# Altium schematic sheet LED_MAX.SchDoc
size 420 x 297 mm; Address1: Address1; Address2: Address2; Address3: Address3; Address4: Address4; SheetNumber: 1; Scale: 1:1; Разраб.: Иванов; Обозначение документа: АБВГ.123456.001 Э3; Пров.: Петров; Утв.: Сидоров; Наименование организации: ОАО "Концерн "МПО-Гидроприбор"; Перв. применение: АБВГ.123456.000; Наименование изделия 1: Плата; Наименование изделия 2: Схема электрическая; Наименование изделия 3: принципиальная; Нач. отд.: Нач. отд.; Фамилия нач. отд.: Сидоров
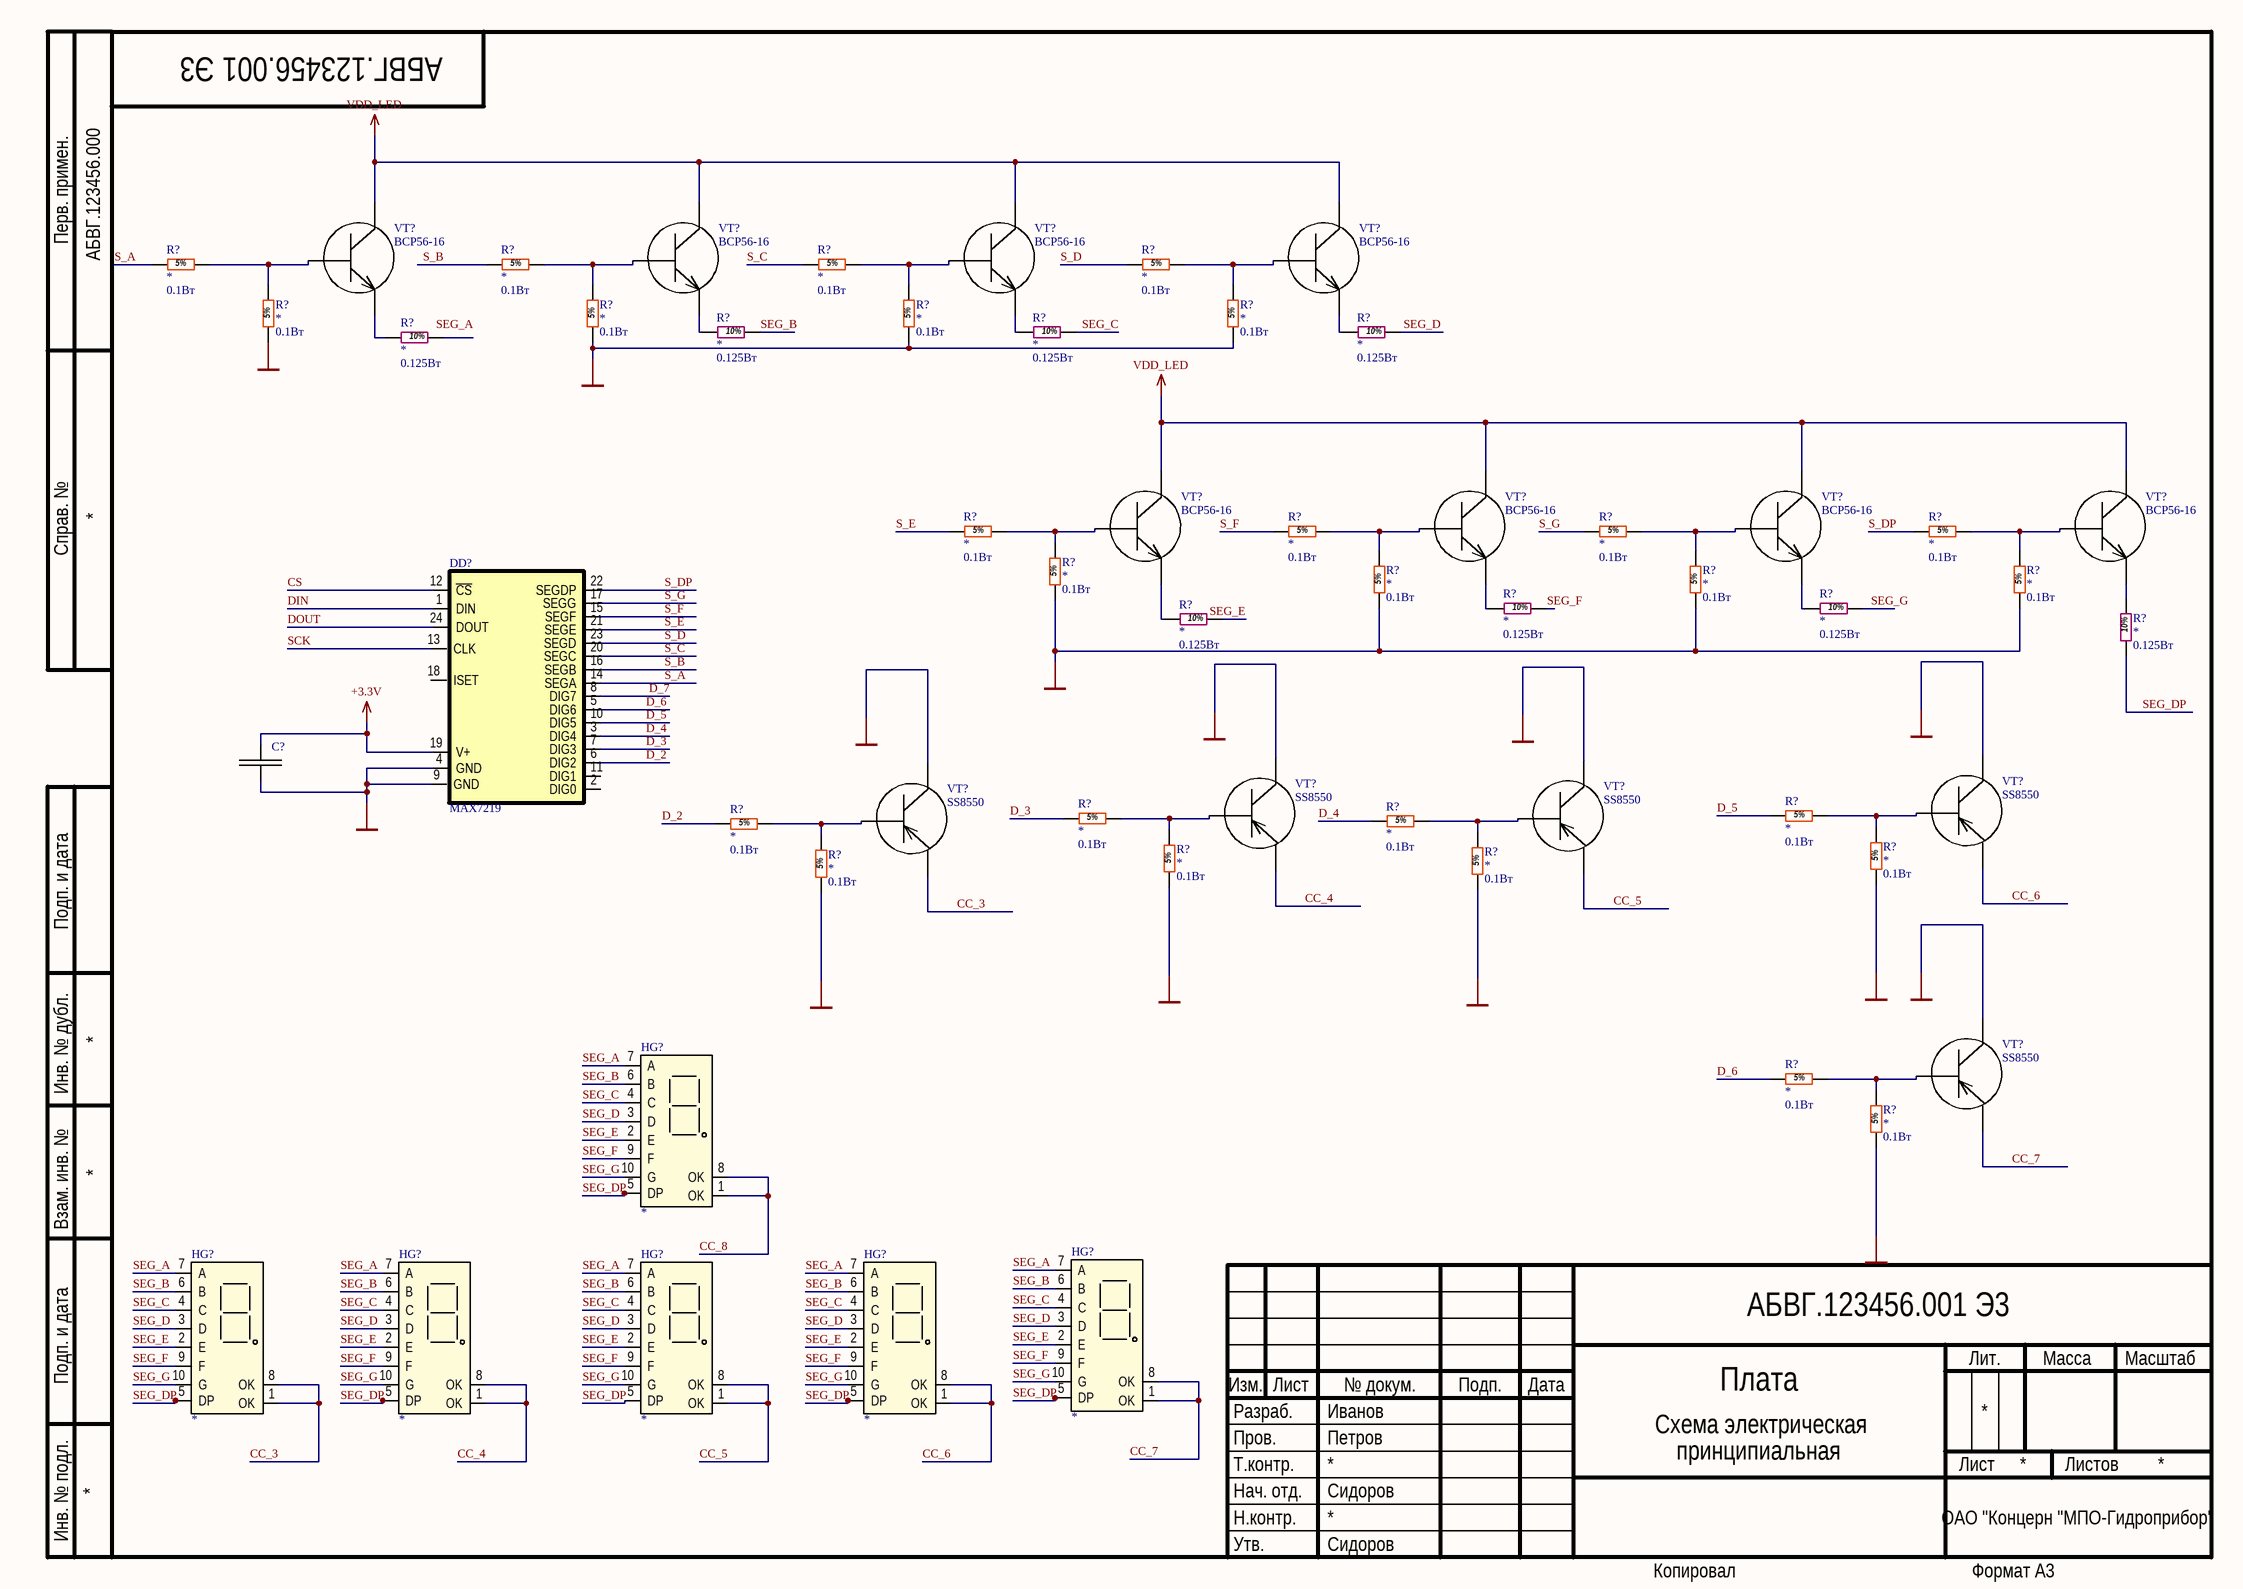
[diagram p0: LED_MAX.SchDoc]

## Parts
(Parts that share a designator on the sheet are numbered #1, #2 ... from top to bottom, then left to right.)
C?  *  [CH0603L]  (value not drawn)
DD?  MAX7219  [SO-24]
HG?#1  *  [FYS-40011]
HG?#2  *  [FYS-40011]
HG?#3  *  [FYS-40011]
HG?#4  *  [FYS-40011]
HG?#5  *  [FYS-40011]
HG?#6  *  [FYS-40011]
R?#1  Power: 0.1Вт  [Res0603]  (hidden comment: *)
R?#2  Power: 0.1Вт  [Res0603]  (hidden comment: *)
R?#3  Power: 0.1Вт  [Res0603]  (hidden comment: *)
R?#4  Power: 0.1Вт  [Res0603]  (hidden comment: *)
R?#5  Power: 0.1Вт  [Res0603]  (hidden comment: *)
R?#6  Power: 0.1Вт  [Res0603]  (hidden comment: *)
R?#7  Power: 0.1Вт  [Res0603]  (hidden comment: *)
R?#8  Power: 0.1Вт  [Res0603]  (hidden comment: *)
R?#9  Power: 0.125Вт  [RES0805]  (hidden comment: *)
R?#10  Power: 0.125Вт  [RES0805]  (hidden comment: *)
R?#11  Power: 0.125Вт  [RES0805]  (hidden comment: *)
R?#12  Power: 0.125Вт  [RES0805]  (hidden comment: *)
R?#13  Power: 0.1Вт  [Res0603]  (hidden comment: *)
R?#14  Power: 0.1Вт  [Res0603]  (hidden comment: *)
R?#15  Power: 0.1Вт  [Res0603]  (hidden comment: *)
R?#16  Power: 0.1Вт  [Res0603]  (hidden comment: *)
R?#17  Power: 0.1Вт  [Res0603]  (hidden comment: *)
R?#18  Power: 0.1Вт  [Res0603]  (hidden comment: *)
R?#19  Power: 0.1Вт  [Res0603]  (hidden comment: *)
R?#20  Power: 0.1Вт  [Res0603]  (hidden comment: *)
R?#21  Power: 0.125Вт  [RES0805]  (hidden comment: *)
R?#22  Power: 0.125Вт  [RES0805]  (hidden comment: *)
R?#23  Power: 0.125Вт  [RES0805]  (hidden comment: *)
R?#24  Power: 0.125Вт  [RES0805]  (hidden comment: *)
R?#25  Power: 0.1Вт  [Res0603]  (hidden comment: *)
R?#26  Power: 0.1Вт  [Res0603]  (hidden comment: *)
R?#27  Power: 0.1Вт  [Res0603]  (hidden comment: *)
R?#28  Power: 0.1Вт  [Res0603]  (hidden comment: *)
R?#29  Power: 0.1Вт  [Res0603]  (hidden comment: *)
R?#30  Power: 0.1Вт  [Res0603]  (hidden comment: *)
R?#31  Power: 0.1Вт  [Res0603]  (hidden comment: *)
R?#32  Power: 0.1Вт  [Res0603]  (hidden comment: *)
R?#33  Power: 0.1Вт  [Res0603]  (hidden comment: *)
R?#34  Power: 0.1Вт  [Res0603]  (hidden comment: *)
VT?#1  BCP56-16  [SOT223]
VT?#2  BCP56-16  [SOT223]
VT?#3  BCP56-16  [SOT223]
VT?#4  BCP56-16  [SOT223]
VT?#5  BCP56-16  [SOT223]
VT?#6  BCP56-16  [SOT223]
VT?#7  BCP56-16  [SOT223]
VT?#8  BCP56-16  [SOT223]
VT?#9  SS8550  [SOT23-3]
VT?#10  SS8550  [SOT23-3]
VT?#11  SS8550  [SOT23-3]
VT?#12  SS8550  [SOT23-3]
VT?#13  SS8550  [SOT23-3]

## Nets
+3.3V: C?.1 DD?.19(V+)
GND: C?.2 DD?.4(GND) DD?.9(GND) R?#5.1 R?#6.1 R?#7.1 R?#8.1 R?#17.1 R?#18.1 R?#19.1 R?#20.1 R?#29.1 R?#30.1 R?#31.1 R?#32.1 R?#34.1 VT?#9.3 VT?#10.3 VT?#11.3 VT?#12.3 VT?#13.3
VDD_LED: VT?#1.2 VT?#2.2 VT?#3.2 VT?#4.2 VT?#5.2 VT?#6.2 VT?#7.2 VT?#8.2
CC_3: HG?#2.1(OK) HG?#2.8(OK) VT?#11.2
CC_4: HG?#3.1(OK) HG?#3.8(OK) VT?#9.2
CC_5: HG?#4.1(OK) HG?#4.8(OK) VT?#12.2
CC_6: HG?#5.1(OK) HG?#5.8(OK) VT?#10.2
CC_7: HG?#6.1(OK) HG?#6.8(OK) VT?#13.2
CC_8: HG?#1.1(OK) HG?#1.8(OK)
CS: DD?.12(~{CS})
D_2: DD?.6(DIG2) R?#26.1
D_3: DD?.7(DIG3) R?#27.1
D_4: DD?.3(DIG4) R?#28.1
D_5: DD?.10(DIG5) R?#25.1
D_6: DD?.5(DIG6) R?#33.1
D_7: DD?.8(DIG7)
DIN: DD?.1(DIN)
DOUT: DD?.24(DOUT)
S_A: DD?.14(SEGA) R?#1.1
S_B: DD?.16(SEGB) R?#2.1
S_C: DD?.20(SEGC) R?#3.1
S_D: DD?.23(SEGD) R?#4.1
S_DP: DD?.22(SEGDP) R?#16.1
S_E: DD?.21(SEGE) R?#13.1
S_F: DD?.15(SEGF) R?#14.1
S_G: DD?.17(SEGG) R?#15.1
SCK: DD?.13(CLK)
SEG_A: HG?#1.7(A) HG?#2.7(A) HG?#3.7(A) HG?#4.7(A) HG?#5.7(A) HG?#6.7(A)
SEG_B: HG?#1.6(B) HG?#2.6(B) HG?#3.6(B) HG?#4.6(B) HG?#5.6(B) HG?#6.6(B) R?#10.2
SEG_C: HG?#1.4(C) HG?#2.4(C) HG?#3.4(C) HG?#4.4(C) HG?#5.4(C) HG?#6.4(C) R?#11.2
SEG_D: HG?#1.3(D) HG?#2.3(D) HG?#3.3(D) HG?#4.3(D) HG?#5.3(D) HG?#6.3(D) R?#12.2
SEG_DP: HG?#1.5(DP) HG?#2.5(DP) HG?#3.5(DP) HG?#4.5(DP) HG?#5.5(DP) HG?#6.5(DP) R?#24.1
SEG_E: HG?#1.2(E) HG?#2.2(E) HG?#3.2(E) HG?#4.2(E) HG?#5.2(E) HG?#6.2(E)
SEG_F: HG?#1.9(F) HG?#2.9(F) HG?#3.9(F) HG?#4.9(F) HG?#5.9(F) HG?#6.9(F) R?#21.2
SEG_G: HG?#1.10(G) HG?#2.10(G) HG?#3.10(G) HG?#4.10(G) HG?#5.10(G) HG?#6.10(G) R?#22.2
NetR?#1_2: R?#1.2 R?#5.2 VT?#1.1
NetR?#2_2: R?#2.2 R?#6.2 VT?#2.1
NetR?#3_2: R?#3.2 R?#7.2 VT?#3.1
NetR?#4_2: R?#4.2 R?#8.2 VT?#4.1
NetR?#9_1: R?#9.1 VT?#1.3
NetR?#10_1: R?#10.1 VT?#2.3
NetR?#11_1: R?#11.1 VT?#3.3
NetR?#12_1: R?#12.1 VT?#4.3
NetR?#13_2: R?#13.2 R?#17.2 VT?#5.1
NetR?#14_2: R?#14.2 R?#18.2 VT?#6.1
NetR?#15_2: R?#15.2 R?#19.2 VT?#7.1
NetR?#16_2: R?#16.2 R?#20.2 VT?#8.1
NetR?#21_1: R?#21.1 VT?#6.3
NetR?#22_1: R?#22.1 VT?#7.3
NetR?#23_1: R?#23.1 VT?#5.3
NetR?#24_2: R?#24.2 VT?#8.3
NetR?#25_2: R?#25.2 R?#30.2 VT?#10.1
NetR?#26_2: R?#26.2 R?#31.2 VT?#11.1
NetR?#27_2: R?#27.2 R?#29.2 VT?#9.1
NetR?#28_2: R?#28.2 R?#32.2 VT?#12.1
NetR?#33_2: R?#33.2 R?#34.2 VT?#13.1

Not connected (* = marked no-connect by the designer): DD? 2(DIG0) 11(DIG1) 18(ISET); R?#9 2; R?#23 2

## Notes on the sheet
- Labels drawn without touching a wire or pin: SEG_A, SEG_E
- Перв. примен.
- Справ. №
- Подп. и дата
- Инв. № дубл.
- Взам. инв. №
- Разраб.
- Изм.
- Лист
- № докум.
- Подп.
- Дата
- Лит.
- Масса
- Масштаб
- Пров.
- Т.контр.
- Листов
- Инв. № подл.
- Утв.
- Н.контр.
- Копировал
- Формат А3

## Library data of the parts
C? = Capasitor: Value: *; Voltage: *; Part Number: *; Quantity: *; Package: *; Price: *; Manufacturer: *; ShoppingPlace: *
DD? = MAX7219: Manufacturer: MAXIM; Part Number: MAX7219; Package: SO-24; Quantity: 1; Tolerance: *; Type: IC; Voltage: *; Power: *
HG?#1-HG?#6 = LED Indicator: Value: *; Quantity: *; Part Number: *; Manufacturer: *; Package: *; Price: *; ShoppingPlace: *; Documentation: *; Type: HG
R?#1-R?#8 R?#13-R?#20 R?#25-R?#34 = Res0603_5%: Voltage: 50В; Tolerance: 5%; Manufacturer: *; Quntity: *; Price: *; Part Number: *; Package: 0603; Doc: *; Value: *
R?#9-R?#12 R?#21-R?#24 = Res0805_10%: Voltage: 150В; Tolerance: 10%; Manufacturer: *; Quntity: *; Price: *; Part Number: *; Package: 0805; Doc: *; Value: *
VT?#1-VT?#8 = BCP56-16: Manufacturer: NXP Semiconductors; Value: 80V,1A; Part Number: BCP56-16; Price: BCP56; Quantity: 2; Documentation: https://assets.nexperia.com/documents/data-sheet/BCP56_BCX56_BC56PA.pdf
VT?#9-VT?#13 = SS8550: Manufacturer: NXP; Value: 45V,100mA; Part Number: SS8550; Price: 1; ShoppingPlace: https://belchip.by/product/?selected_product=29133; Quantity: 1; Package: SOT-23; Documentation: https://belchip.by/sitedocs/ss8550.pdf